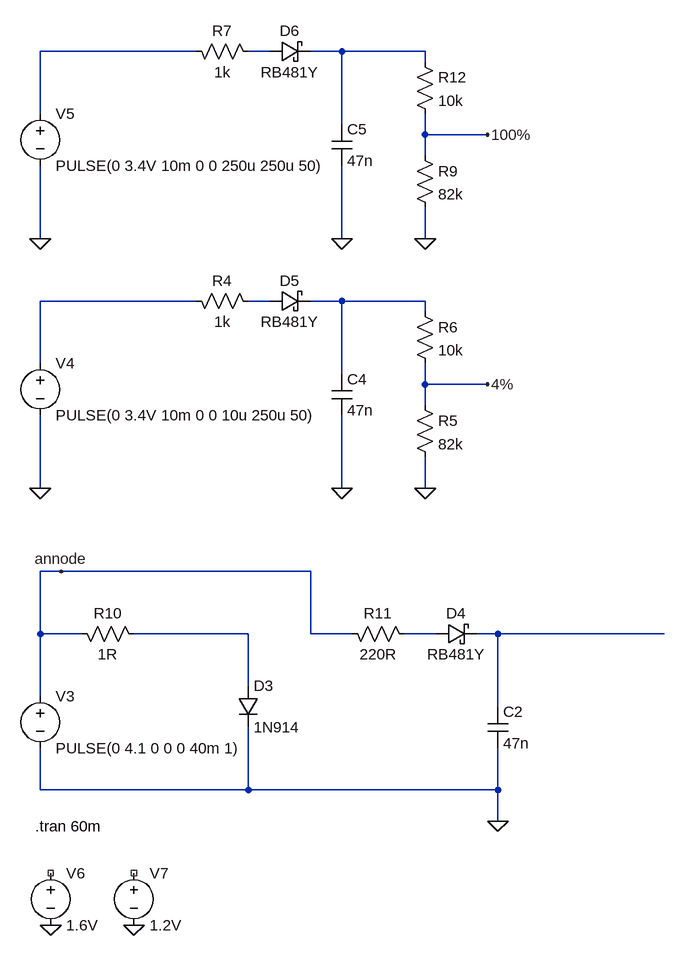
[diagram p0: schematic LTSpice_LED-PWM-simulation.asc]
LTSpice_LED-PWM-simulation.asc, the LTspice schematic file:
Version 4
SHEET 1 1644 1316
WIRE -1536 -304 -1776 -304
WIRE -1424 -304 -1456 -304
WIRE -1312 -304 -1360 -304
WIRE -1184 -304 -1312 -304
WIRE -1184 -288 -1184 -304
WIRE -1776 -208 -1776 -304
WIRE -1312 -192 -1312 -304
WIRE -1184 -176 -1184 -208
WIRE -1088 -176 -1184 -176
WIRE -1184 -144 -1184 -176
WIRE -1776 -16 -1776 -128
WIRE -1312 -16 -1312 -128
WIRE -1184 -16 -1184 -64
WIRE -1536 80 -1776 80
WIRE -1424 80 -1456 80
WIRE -1312 80 -1360 80
WIRE -1184 80 -1312 80
WIRE -1184 96 -1184 80
WIRE -1776 176 -1776 80
WIRE -1312 192 -1312 80
WIRE -1184 208 -1184 176
WIRE -1088 208 -1184 208
WIRE -1184 240 -1184 208
WIRE -1776 368 -1776 256
WIRE -1312 368 -1312 256
WIRE -1184 368 -1184 320
WIRE -1744 496 -1776 496
WIRE -1360 496 -1744 496
WIRE -1776 592 -1776 496
WIRE -1712 592 -1776 592
WIRE -1456 592 -1632 592
WIRE -1360 592 -1360 496
WIRE -1296 592 -1360 592
WIRE -1168 592 -1216 592
WIRE -1072 592 -1104 592
WIRE -816 592 -1072 592
WIRE -1456 672 -1456 592
WIRE -1776 688 -1776 592
WIRE -1072 704 -1072 592
WIRE -1776 832 -1776 768
WIRE -1456 832 -1456 736
WIRE -1456 832 -1776 832
WIRE -1072 832 -1072 768
WIRE -1072 832 -1456 832
WIRE -1072 880 -1072 832
FLAG -1072 880 0
FLAG -1744 496 annode
FLAG -1312 368 0
FLAG -1184 368 0
FLAG -1088 208 4%
FLAG -1312 -16 0
FLAG -1184 -16 0
FLAG -1088 -176 100%
FLAG -1760 1040 0
FLAG -1632 1040 0
FLAG -1776 368 0
FLAG -1776 -16 0
SYMBOL voltage -1776 672 R0
WINDOW 123 0 0 Left 0
WINDOW 39 0 0 Left 0
SYMATTR InstName V3
SYMATTR Value PULSE(0 4.1 0 0 0 40m 1)
SYMBOL res -1616 608 M270
WINDOW 0 32 56 VTop 2
WINDOW 3 0 56 VBottom 2
SYMATTR InstName R10
SYMATTR Value 1R
SYMBOL diode -1472 672 R0
SYMATTR InstName D3
SYMATTR Value 1N914
SYMATTR Description Light Emitting Diode
SYMATTR Type led
SYMBOL cap -1088 704 R0
SYMATTR InstName C2
SYMATTR Value 47n
SYMBOL schottky -1168 608 R270
WINDOW 0 32 32 VTop 2
WINDOW 3 0 32 VBottom 2
SYMATTR InstName D4
SYMATTR Value RB481Y
SYMBOL res -1200 608 M270
WINDOW 0 32 56 VTop 2
WINDOW 3 0 56 VBottom 2
SYMATTR InstName R11
SYMATTR Value 220R
SYMBOL voltage -1776 160 R0
WINDOW 123 0 0 Left 0
WINDOW 39 0 0 Left 0
SYMATTR InstName V4
SYMATTR Value PULSE(0 3.4V 10m 0 0 10u 250u 50)
SYMBOL cap -1328 192 R0
SYMATTR InstName C4
SYMATTR Value 47n
SYMBOL res -1440 96 M270
WINDOW 0 32 56 VTop 2
WINDOW 3 0 56 VBottom 2
SYMATTR InstName R4
SYMATTR Value 1k
SYMBOL res -1200 224 R0
SYMATTR InstName R5
SYMATTR Value 82k
SYMBOL schottky -1424 96 R270
WINDOW 0 32 32 VTop 2
WINDOW 3 0 32 VBottom 2
SYMATTR InstName D5
SYMATTR Value RB481Y
SYMBOL res -1200 80 R0
SYMATTR InstName R6
SYMATTR Value 10k
SYMBOL voltage -1776 -224 R0
WINDOW 123 0 0 Left 0
WINDOW 39 0 0 Left 0
SYMATTR InstName V5
SYMATTR Value PULSE(0 3.4V 10m 0 0 250u 250u 50)
SYMBOL cap -1328 -192 R0
SYMATTR InstName C5
SYMATTR Value 47n
SYMBOL res -1440 -288 M270
WINDOW 0 32 56 VTop 2
WINDOW 3 0 56 VBottom 2
SYMATTR InstName R7
SYMATTR Value 1k
SYMBOL res -1200 -160 R0
SYMATTR InstName R9
SYMATTR Value 82k
SYMBOL schottky -1424 -288 R270
WINDOW 0 32 32 VTop 2
WINDOW 3 0 32 VBottom 2
SYMATTR InstName D6
SYMATTR Value RB481Y
SYMBOL res -1200 -304 R0
SYMATTR InstName R12
SYMATTR Value 10k
SYMBOL voltage -1760 944 R0
WINDOW 123 0 0 Left 0
WINDOW 39 0 0 Left 0
SYMATTR InstName V6
SYMATTR Value 1.6V
SYMBOL voltage -1632 944 R0
WINDOW 123 0 0 Left 0
WINDOW 39 0 0 Left 0
SYMATTR InstName V7
SYMATTR Value 1.2V
TEXT -1784 888 Left 2 !.tran 60m

The netlist it stands for:
* LTSpice_LED-PWM-simulation.asc
V3 annode 0 PULSE(0 4.1 0 0 0 40m 1)
R10 N007 annode 1R
D3 N007 0 1N914
C2 N009 0 47n
D4 N008 N009 RB481Y
R11 N008 annode 220R
V4 N004 0 PULSE(0 3.4V 10m 0 0 10u 250u 50)
C4 N006 0 47n
R4 N005 N004 1k
R5 4% 0 82k
D5 N005 N006 RB481Y
R6 N006 4% 10k
V5 N001 0 PULSE(0 3.4V 10m 0 0 250u 250u 50)
C5 N003 0 47n
R7 N002 N001 1k
R9 100% 0 82k
D6 N002 N003 RB481Y
R12 N003 100% 10k
V6 NC_01 0 1.6V
V7 NC_02 0 1.2V
.model D D
.lib standard.dio
.tran 60m
.backanno
.end